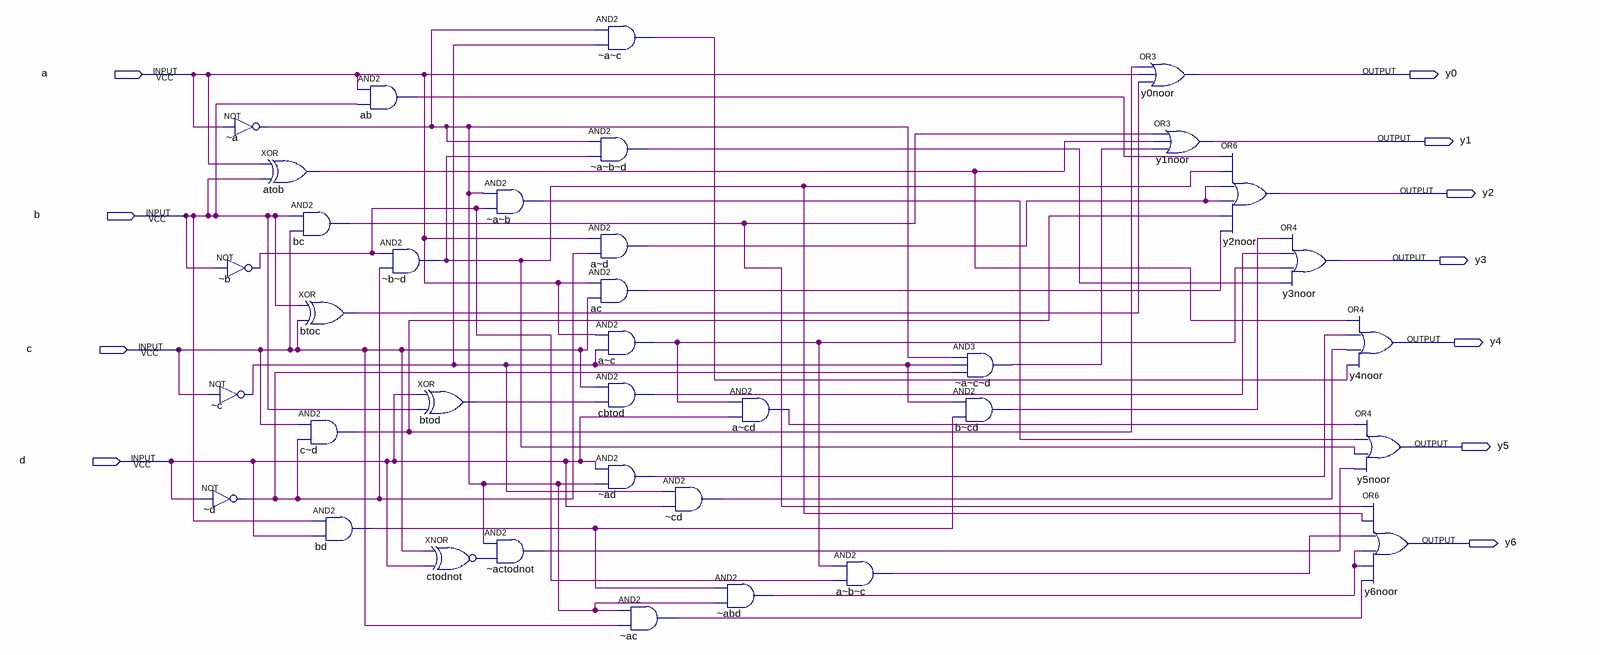
[diagram p0: schematic sheet]
// Quartus schematic kadai1.bdf as structural Verilog: 36 symbols, 11 pins
module kadai1 (
  input  a,
  input  b,
  input  c,
  input  d,
  output y0,
  output y1,
  output y2,
  output y3,
  output y4,
  output y5,
  output y6
);

  wire _a_b_d_out, _a_b_out, _a_c_d_out, _a_c_out, _a_out, _abd_out, _ac_out, _actodnot_out, _ad_out,
       _b_d_out, _b_out, _c_out, _cd_out, _d_out, a_b_c_out, a_c_out, a_cd_out, a_d_out, ab_out, ac_out,
       atob_out, b_cd_out, bc_out, bd_out, btoc_out, btod_out, c_d_out, cbtod_out, ctodnot_out;

  not \u_~b  (_b_out, b);
  not \u_~c  (_c_out, c);
  not \u_~d  (_d_out, d);
  not \u_~a  (_a_out, a);
  xor atob (atob_out, a, b);
  and bc (bc_out, b, c);
  xor btoc (btoc_out, b, c);
  and \c~d  (c_d_out, c, _d_out);
  and bd (bd_out, b, d);
  and ab (ab_out, a, b);
  and \u_~b~d  (_b_d_out, _b_out, _d_out);
  xor btod (btod_out, d, b);
  xnor ctodnot (ctodnot_out, c, d);
  and \u_~a~b  (_a_b_out, _a_out, _b_out);
  and \u_~actodnot  (_actodnot_out, _a_out, ctodnot_out);
  and \u_~a~c  (_a_c_out, _a_out, _c_out);
  and \u_~a~b~d  (_a_b_d_out, _a_out, _b_d_out);
  and \a~d  (a_d_out, a, _d_out);
  and ac (ac_out, a, c);
  and \a~c  (a_c_out, a, _c_out);
  and cbtod (cbtod_out, c, btod_out);
  and \u_~ad  (_ad_out, d, _a_out);
  and \u_~ac  (_ac_out, _a_out, c);
  and \u_~cd  (_cd_out, _c_out, d);
  and \a~cd  (a_cd_out, a_c_out, d);
  and \u_~abd  (_abd_out, bd_out, _a_out);
  and \a~b~c  (a_b_c_out, a_c_out, _b_out);
  and \u_~a~c~d  (_a_c_d_out, _a_out, _c_out, _d_out);
  and \b~cd  (b_cd_out, _c_out, bd_out);
  or y0noor (y0, c_d_out, a, btoc_out);
  or y1noor (y1, bc_out, atob_out, _a_c_d_out);
  or y2noor (y2, ab_out, _b_d_out, a_d_out, a_d_out, c_d_out, ac_out);
  or y3noor (y3, b_cd_out, cbtod_out, a_c_out, _a_b_d_out);
  or y4noor (y4, atob_out, _ad_out, _cd_out, _a_c_out);
  or y5noor (y5, a_cd_out, _a_b_out, _b_d_out, _actodnot_out);
  or y6noor (y6, bc_out, _b_d_out, a_b_c_out, _abd_out, _abd_out, _ac_out);
endmodule
